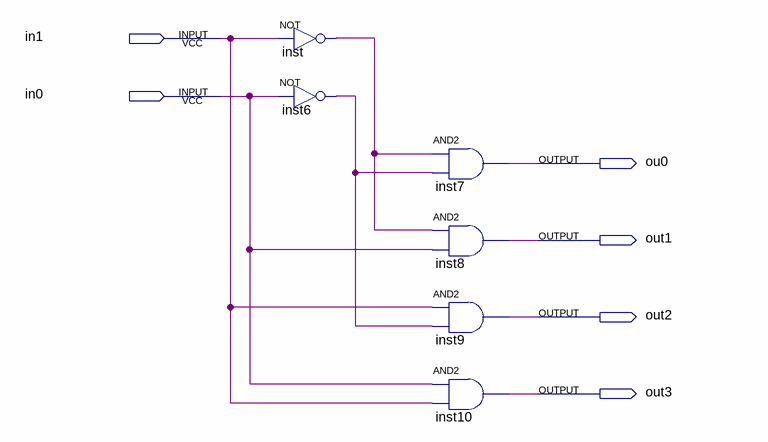
[diagram p0: schematic sheet]
// Quartus schematic dec2b.bdf as structural Verilog: 6 symbols, 6 pins
module dec2b (
  input  in1,
  input  in0,
  output ou0,
  output out1,
  output out2,
  output out3
);

  wire inst6_out, inst_out;

  not inst (inst_out, in1);
  not inst6 (inst6_out, in0);
  and inst7 (ou0, inst_out, inst6_out);
  and inst8 (out1, inst_out, in0);
  and inst9 (out2, in1, inst6_out);
  and inst10 (out3, in0, in1);
endmodule
